# EAGLE design orb (EAGLE 6.5.0)
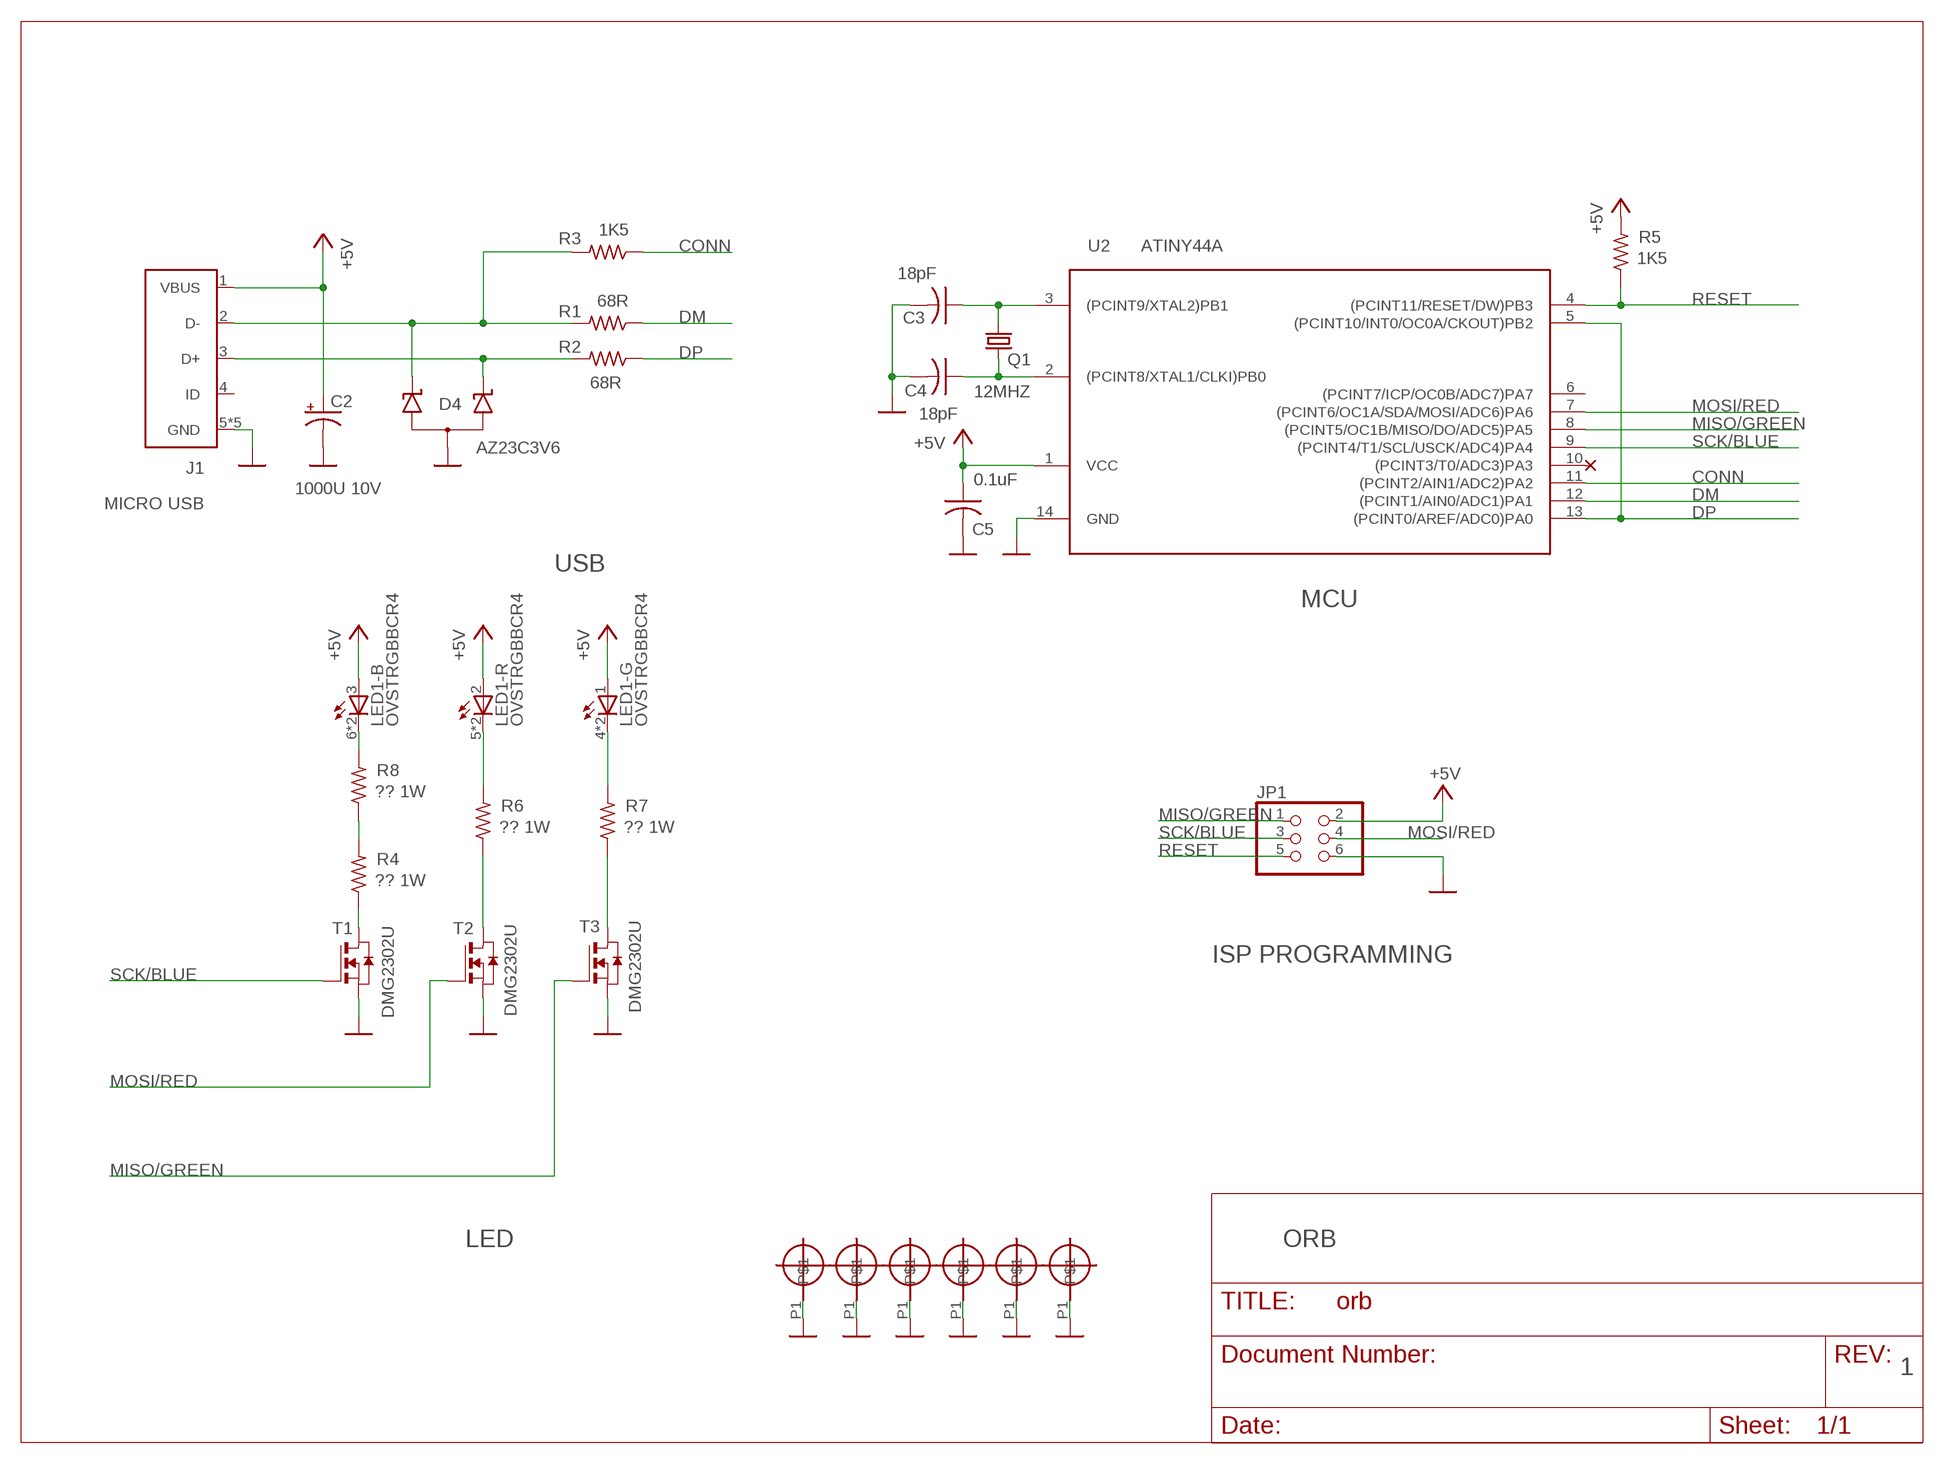
[diagram p0: schematic, sheet 1]

## Parts
C2  1000U 10V  CPOL-US153CLV-1010  [153CLV-1010]
C3  18pF  C-USC0805  [C0805]
C4  18pF  C-USC0805  [C0805]
C5  0.1uF  C-USC0805  [C0805]
D4  AZ23C3V6  BAS40-06  [SOT23]
J1  MICRO USB  USB  [USB-MICRO]
JP1  PINHD-2X3  [2X03]
LED1  OVSTRGBBCR4  [OVSTRGBBCR4]
Q1  12MHZ  CRYSTAL  [CRYSTAL]
R1  68R  R-US_R0805  [R0805]
R2  68R  R-US_R0805  [R0805]
R3  1K5  R-US_R0805  [R0805]
R4  ?? 1W  R-US_R2512W  [R2512W]
R5  1K5  R-US_R0805  [R0805]
R6  ?? 1W  R-US_R2512W  [R2512W]
R7  ?? 1W  R-US_R2512W  [R2512W]
R8  ?? 1W  R-US_R2512W  [R2512W]
T1  DMG2302U  NMOSSOT23  [SOT-23]
T2  DMG2302U  NMOSSOT23  [SOT-23]
T3  DMG2302U  NMOSSOT23  [SOT-23]
U2  ATINY44A  TINY24/44/84-SSU  [SOIC14]
U$1  MOUNTING_HOLE  [MOUNTING_HOLE]
U$2  MOUNTING_HOLE  [MOUNTING_HOLE]
U$3  MOUNTING_HOLE  [MOUNTING_HOLE]
U$4  MOUNTING_HOLE  [MOUNTING_HOLE]
U$5  MOUNTING_HOLE  [MOUNTING_HOLE]
U$12  MOUNTING_HOLE  [MOUNTING_HOLE]

## Nets
+5V: C2.+ C5.1 J1.1(VBUS) JP1.2 LED1.1(-G:A) LED1.2(-R:A) LED1.3(-B:A) R5.2 U2.1(VCC)
CONN: R3.1 U2.11((PCINT2/AIN1/ADC2)PA2)
DM: R1.1 U2.12((PCINT1/AIN0/ADC1)PA1)
DP: R2.1 U2.5((PCINT10/INT0/OC0A/CKOUT)PB2) U2.13((PCINT0/AREF/ADC0)PA0)
GND: C2.- C3.2 C4.2 C5.2 D4.3(AA) J1.5(GND) J1.G1(GND) J1.G2(GND) J1.G3(GND) J1.G4(GND) JP1.6 T1.2(S) T2.2(S) T3.2(S) U2.14(GND) U$1.P1 U$2.P1 U$3.P1 U$4.P1 U$5.P1 U$12.P1 ; supply symbol labelled AZ23C3V6
MISO/GREEN: JP1.1 T3.3(G) U2.8((PCINT5/OC1B/MISO/DO/ADC5)PA5)
MOSI/RED: JP1.4 T2.3(G) U2.7((PCINT6/OC1A/SDA/MOSI/ADC6)PA6)
N$1: C3.1 Q1.2 U2.3((PCINT9/XTAL2)PB1)
N$3: C4.1 Q1.1 U2.2((PCINT8/XTAL1/CLKI)PB0)
N$4: R4.2 R8.1
N$5: D4.1(K1) J1.2(D-) R1.2 R3.2
N$6: D4.2(K2) J1.3(D+) R2.2
N$7: LED1.6(-B:C) LED1.6@1(-B:C) R8.2
N$8: LED1.5(-R:C) LED1.5@1(-R:C) R6.2
N$9: LED1.4(-G:C) LED1.4@1(-G:C) R7.2
N$13: R4.1 T1.1(D)
N$14: R6.1 T2.1(D)
N$15: R7.1 T3.1(D)
RESET: JP1.5 R5.1 U2.4((PCINT11/RESET/DW)PB3)
SCK/BLUE: JP1.3 T1.3(G) U2.9((PCINT4/T1/SCL/USCK/ADC4)PA4)
Unconnected: J1.4(ID) U2.6((PCINT7/ICP/OC0B/ADC7)PA7) U2.10((PCINT3/T0/ADC3)PA3)

## Notes on the sheet
- USB
- MCU
- ISP PROGRAMMING
- LED | ORB
- 1

## Library data of the parts
C2 = rcl:CPOL-US: POLARIZED CAPACITOR, American symbol
C3-C5 = rcl:C-US: CAPACITOR, American symbol
D4 = orb:BAS40-06: Silicon Schottky Diodes General-purpose diode for high-speed switching
J1 = arm-pro-mini:USB
JP1 = pmon_3v8:PINHD-2X3
LED1 = orb:OVSTRGBBCR4: Full Color PLCC6 LED OVSTRGBBCR8 Source: www.optekinc.com .. ovstrgbbcr8.pdf
Q1 = orb:CRYSTAL: SMD CRYSTAL Source: www.ecsxtal.com .. Crystal 3.6864MHz CSM_7X_DU.PDF; OC_FARNELL: unknown; OC_NEWARK: unknown
R1-R8 = rcl:R-US_: RESISTOR, American symbol
T1-T3 = zetex:NMOSSOT23: MOS FET; OC_FARNELL: unknown; OC_NEWARK: unknown
U2 = orb:TINY24/44/84
U$1-U$5 U$12 = orb:MOUNTING_HOLE

## Net classes
1 power: width 0.254 mm

## Board
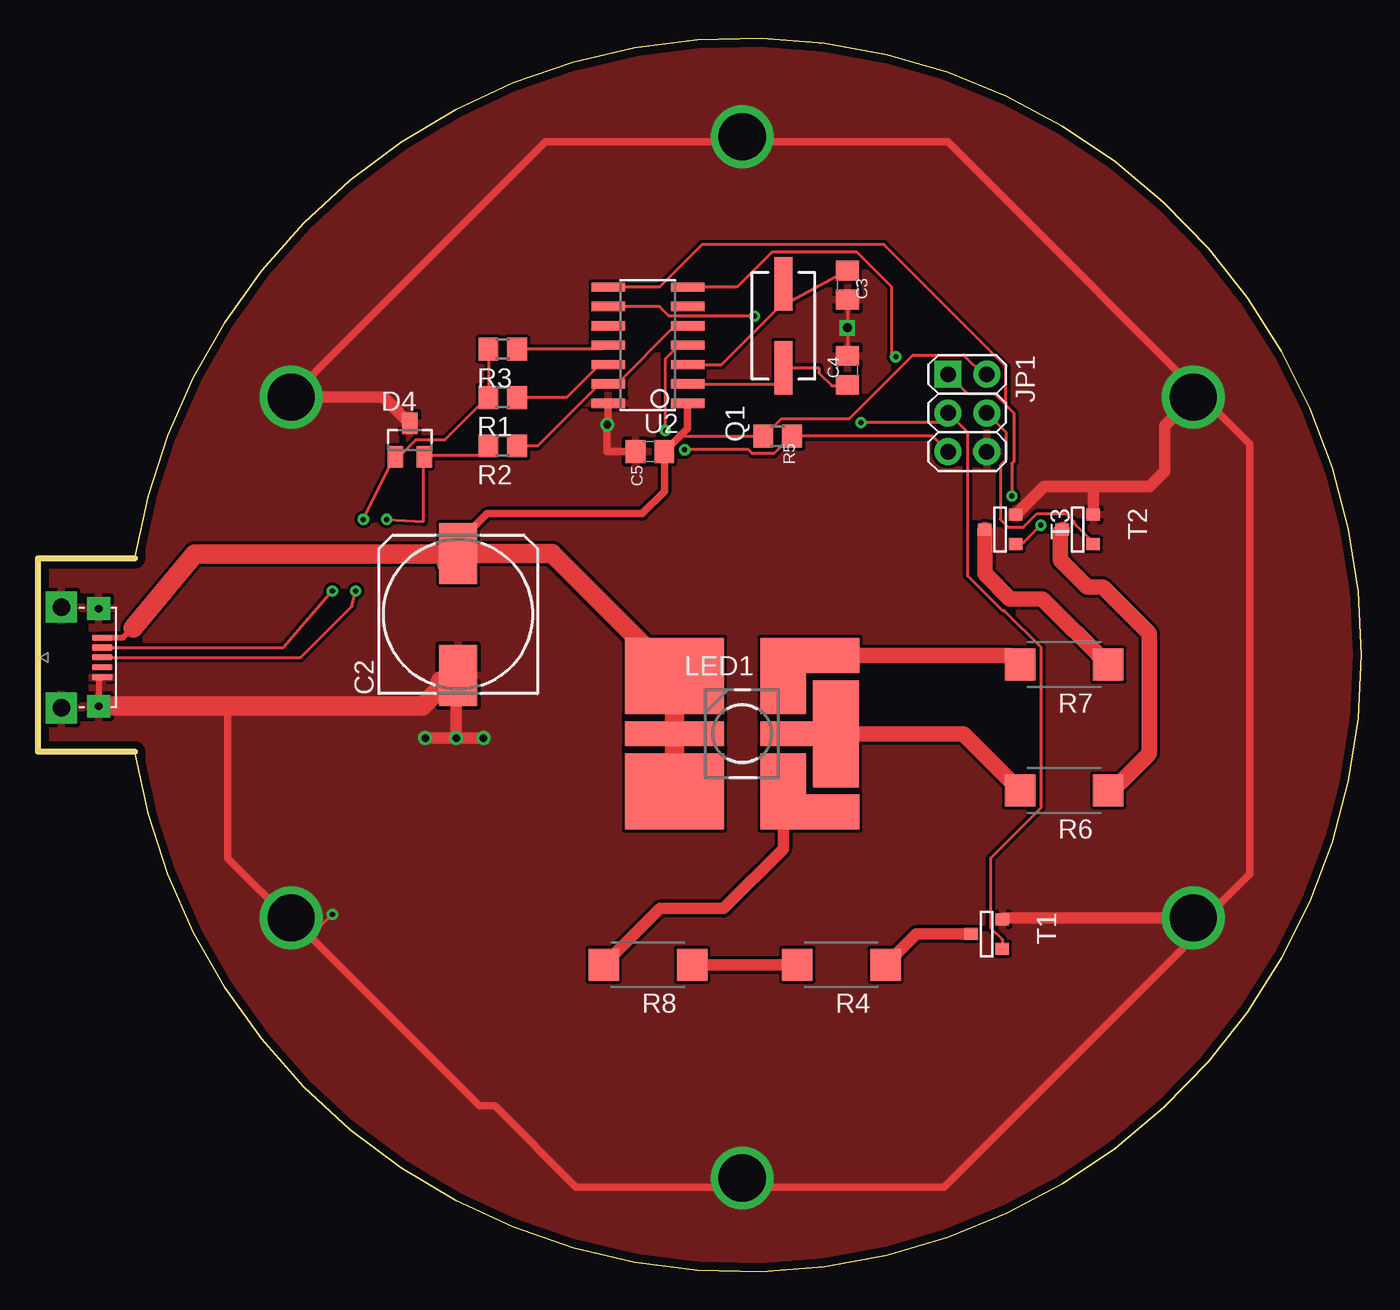
[diagram p1: board, top side]
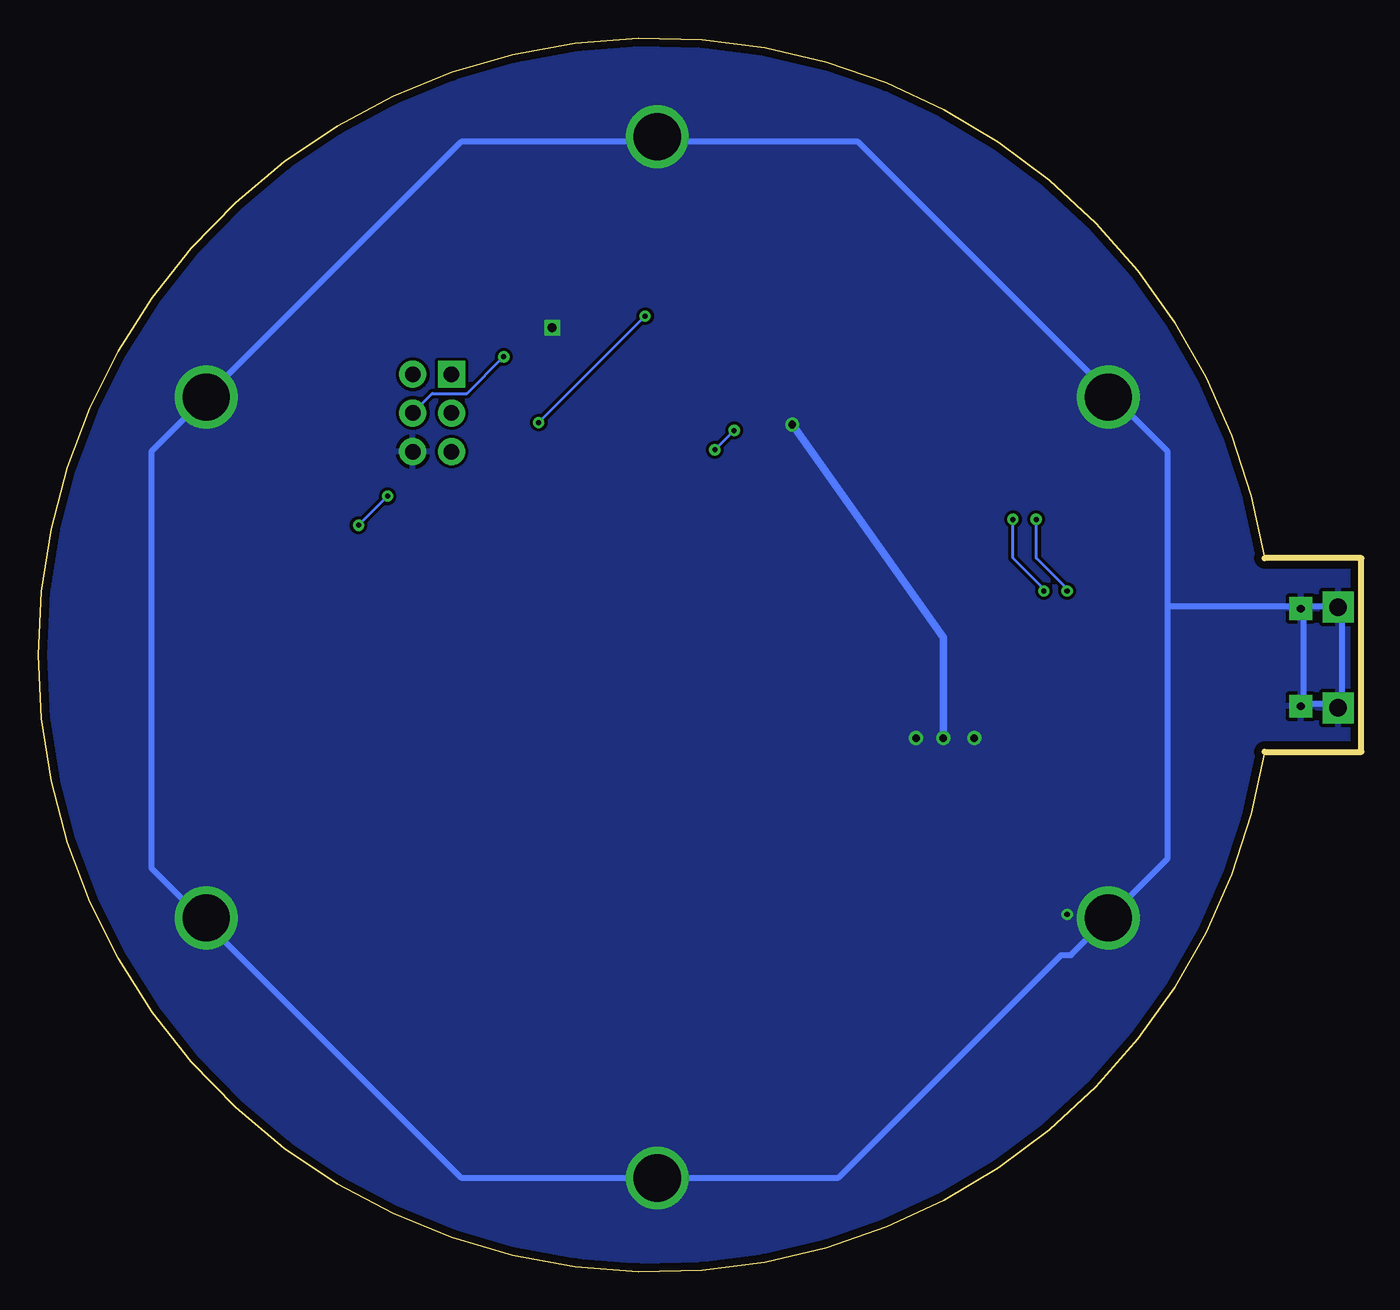
[diagram p2: board, bottom side, seen from below]

Size 86.81 x 80.93 mm. Coordinates in mm from the lower left corner, seen from the top.
Outline: 6.35,46.82 arc-342 6.35,34.12 0,34.12 0,46.82 6.35,46.82
Copper layers (1*16): Top 0.035mm / dielectric 1.5mm / Bottom 0.035mm
Design rules "default *": minimum track width 8mil, minimum drill 13mil, track to track 8mil, track to pad 8mil, pad to pad 8mil, via to via 8mil, smd to smd 0mil, copper to edge 20mil, drill to drill 8mil, minimum pad ring 7mil, minimum via ring 8mil, stop-mask expansion 4mil, vias tented up to drill 20mil, thermal gap 10mil

### Footprints (pad centres in the part's own frame; a part is rotated, then mirrored left to right if it is on the bottom)
153CLV-1010 = smd 4 x 2.5: + 4,0; - -4,0
C0805 = smd 1.3 x 1.5: 1 -0.95,0; 2 0.95,0
SOT23 = smd 1 x 1.4: 1 -0.95,-1.1; 2 0.95,-1.1; 3 0,1.1
USB-MICRO = smd 0.4 x 1.35: 1 -1.3,2.675; 2 -0.65,2.675; 3 0,2.675; 4 0.65,2.675; 5 1.3,2.675 | drill 1.143 pad 2.032 square: G1 -3.3,0; G2 3.3,0 | drill 0.508 pad 1.5 square: G3 -3.2,2.45; G4 3.2,2.45
2X03 = drill 1.016 pad 1.778 square: 1 -2.54,-1.27 | drill 1.016 pad 1.778: 2 -2.54,1.27; 3 0,-1.27; 4 0,1.27; 5 2.54,-1.27; 6 2.54,1.27
OVSTRGBBCR4 = smd 6.5 x 5: 1 -4.442,3.786; 3 -4.442,-3.786 | smd 6.5 x 1.6: 2 -4.442,0 | smd 3 x 5: 4 2.692,3.786; 6 2.692,-3.786 | smd 6.5 x 2.3: 4@1 4.442,5.136; 6@1 4.442,-5.136 | smd 5 x 1.6: 5 3.692,0 | smd 3 x 7: 5@1 6.15,-0.025
CRYSTAL = smd 3.5 x 1.2: 1 -2.75,0; 2 2.75,0
R0805 = smd 1.3 x 1.5: 1 -0.95,0; 2 0.95,0
R2512W = smd 2 x 2.1: 1 -2.896,0; 2 2.896,0
SOT-23 = smd 0.787 x 0.889: 1 0.025,-1.016; 2 -0.94,1.016; 3 0.991,1.016
SOIC14 = smd 0.61 x 2.21: 1 -3.81,-2.603; 2 -2.54,-2.603; 3 -1.27,-2.603; 4 0,-2.603; 5 1.27,-2.603; 6 2.54,-2.603; 7 3.81,-2.603; 8 3.81,2.603; 9 2.54,2.603; 10 1.27,2.603; 11 0,2.603; 12 -1.27,2.603; 13 -2.54,2.603; 14 -3.81,2.603
MOUNTING_HOLE = drill 3.1: P1 0,0

### Placement (x,y rotation side)
C2  27.56,43.13 90 top
C3  53.09,64.72 270 top
C4  53.09,59.13 90 top
C5  40.13,53.8 180 top
D4  24.38,54.56 0 top
J1  1.52,40.3 270 top
JP1  60.96,56.34 270 top
LED1  46.19,35.3 0 top
Q1  48.89,62.06 90 top
R1  30.48,57.36 180 top
R2  30.48,54.18 180 top
R3  30.48,60.53 180 top
R4  52.7,20.15 180 top
R5  48.51,54.82 180 top
R6  67.31,31.58 180 top
R7  67.31,39.83 180 top
R8  40,20.15 180 top
T1  62.23,22.18 270 top
T2  68.2,48.72 270 top
T3  63.12,48.72 270 top
U2  40,60.79 90 top
U$1  75.78,23.22 0 top
U$2  46.19,74.47 0 top
U$3  75.78,57.38 0 top
U$4  16.6,57.38 0 top
U$5  46.19,6.14 0 top
U$12  16.6,23.22 0 top

### Tracks (layer width: path | path; a pad name or v marks a point on that pad's centre or on a via)
+5V
  Top 0.203: 42.26,54.98 42.42,54.82 R5.2 47.62,54.82 48.77,55.96 53.21,55.96 57.4,60.15 60.71,60.15 61.98,58.88 JP1.2 | 27.69,47.96 27.69,47.7 C2.+ | LED1.3 41.78,31.58 41.75,31.58 | LED1.2 41.78,35.39 41.75,35.39
  Top 0.406: J1.1 5.58,41.6 6.22,42.24
  Top 0.508: U2.1 42.61,55.33 42.26,54.98 C5.1 41.08,51.19 39.62,49.74 29.46,49.74 27.69,47.96
  Top 1.27: 6.22,42.24 10.29,47.07 26.92,47.07 26.8,46.43 C2.+ 33.7,47.13 LED1.1 41.75,35.39 LED1.2 41.75,31.58 LED1.3 41.75,30.85 41.91,30.69
CONN
  Top 0.203: R3.1 37.08,60.53 37.34,60.79 U2.11
DM
  Top 0.203: R1.1 34.67,57.36 36.83,59.52 U2.12
DP
  Top 0.203: R2.1 32.77,54.18 36.83,58.25 U2.13 37.97,58.25 41.78,62.06 U2.5
GND  (via drill 0.33, 0.51, 0.6)
  Top 0.203: C3.2 v53.09,61.93 C4.2 | C5.2 39.37,53.8 | 17.84,21.99 v19.3,23.45
  Top 0.406: J1.5 3.97,38.78 J1.G4
  Top 0.508: U2.14 37.4,55.58 37.34,55.52 37.34,53.8 C5.2 39.12,53.8 | 39.37,53.8 39.37,53.55 | 16.51,57.36 33.27,74.12 59.69,74.12 79.5,54.31 79.5,26.11 75.95,22.56 75.95,22.05 59.44,5.54 35.31,5.54 29.97,10.87 28.96,10.87 17.84,21.99 16.51,23.32 | 16.76,22.81 12.45,27.13 12.45,37.1 12.45,37.29
  Top 0.762: v27.43,35 27.43,39.07 | v25.4,35 v29.21,35 | U$4.P1 22.67,57.38 D4.3 | U$1.P1 63.35,23.22 T1.2 | U$3.P1 73.91,55.51 73.91,52.53 72.9,51.51 69.34,51.51 | 69.34,51.51 65.99,51.51 T3.2 | T2.2 69.22,51.39 69.34,51.51
  Top 1.27: J1.G4 12.45,37.1 25.21,37.1 26.42,38.31 26.42,38.75 C2.-
  Bottom 0.406: 12.7,43.64 12.7,27.13 19.05,20.78 19.69,20.78 34.29,6.18 59.05,6.18 79.38,26.5 79.38,53.8 59.05,74.12 33.02,74.12 12.7,53.8 12.7,43.64 | 3.81,43.64 3.81,37.29 1.27,37.29 1.27,43.64 12.7,43.64
  Bottom 0.508: v27.43,35 27.43,41.61 v37.34,55.58
  pour Bottom: -2.54,84.28 96.52,84.28 96.52,-4.62 -2.54,-4.62
  pour Top: 5.59,76.15 13.72,84.28 76.96,84.28 95.5,65.74 95.5,15.19 78.49,-1.83 14.22,-1.83 0,12.4 0,69.8 2.29,74.63 3.81,75.14
MISO/GREEN  (via drill 0.33)
  Top 0.203: v65.79,48.97 64.64,47.83 64.13,47.83 T3.3 | v63.88,50.88 63.88,53.04 64.01,53.17 64.01,56.34 63.44,56.91 | 63.44,56.91 62.74,57.61 60.96,57.61 JP1.1 | U2.8 40.77,64.6 43.56,67.39 55.5,67.39 63.5,59.39 63.5,56.98 63.44,56.91
  Bottom 0.203: v63.88,50.88 v65.79,48.97
MOSI/RED  (via drill 0.33)
  Top 0.203: JP1.4 63.5,55.07 63.5,53.29 63.12,52.91 63.12,49.36 63.63,48.85 64.64,48.85 65.53,49.74 67.44,49.74 67.94,49.23 67.94,49.1 69.22,47.83 T2.3 | U2.7 45.85,64.6 48.13,66.88 53.72,66.88 56.01,64.6 56.01,60.28 v56.26,60.02
  Bottom 0.203: v56.26,60.02 58.67,57.61 60.96,57.61 JP1.4
N$1
  Top 0.203: U2.3 44.83,59.52 48.96,63.64 | 48.96,63.64 49.02,63.71 49.02,63.96 49.34,63.64 C3.1 | Q1.2 48.89,63.71 48.96,63.64
N$3
  Top 0.203: U2.2 48.64,58.25 49.02,58.63 49.02,59.26 Q1.1 51.22,59.31 51.22,58.96 52.07,58.12 53.02,58.12 C4.1
N$4
  Top 0.762: R8.1 R4.2
N$5  (via drill 0.33)
  Top 0.203: J1.2 16.11,40.95 v19.3,44.66 | R3.2 29.59,60.53 29.59,57.36 R1.2 29.46,57.36 26.67,54.56 24.77,54.56 23.75,53.55 23.5,53.55 D4.1 23.37,53.42 v21.34,49.36
  Bottom 0.203: v19.3,44.66 19.3,44.78 21.34,46.82 v21.34,49.36
N$6  (via drill 0.33)
  Top 0.203: J1.3 17.23,40.3 20.57,43.64 v20.83,44.66 | R2.2 29.46,54.18 28.83,53.55 25.4,53.55 D4.2 25.27,53.42 25.27,49.23 v22.86,49.36
  Bottom 0.203: v20.83,44.66 20.83,44.78 22.86,46.82 v22.86,49.36
N$7
  Top 0.762: LED1.6 48.88,27.75 44.96,23.83 40.79,23.83 R8.2
N$8
  Top 1.016: LED1.5@1 60.71,35.28 R6.2
N$9
  Top 1.016: LED1.4@1 63.81,40.44 R7.2
N$13
  Top 0.762: T1.1 57.61,22.15 R4.1
N$14
  Top 1.016: R6.1 70.48,31.58 72.9,33.99 72.9,41.86 69.85,44.91 68.83,44.91 67.06,46.69 67.06,48.57 T2.1
N$15
  Top 1.016: T3.1 62.1,45.8 63.75,44.15 65.89,44.15 R7.1
RESET  (via drill 0.33)
  Top 0.203: JP1.5 58.67,54.82 R5.1 49.4,54.82 48.26,53.67 46.86,53.67 46.61,53.93 v42.42,53.93 | U2.4 42.04,60.79 41.15,59.9 v41.15,55.2
  Bottom 0.203: v42.42,53.93 v41.15,55.2
SCK/BLUE  (via drill 0.33)
  Top 0.203: T1.3 63.25,21.8 62.48,22.56 62.48,27.13 65.79,30.43 65.79,40.97 63.37,43.39 63.25,43.39 60.96,45.67 60.96,55.07 JP1.3 60.2,55.71 v53.97,55.71 | U2.9 40.77,63.33 41.4,62.69 v46.99,62.69
  Bottom 0.203: v53.97,55.71 v46.99,62.69